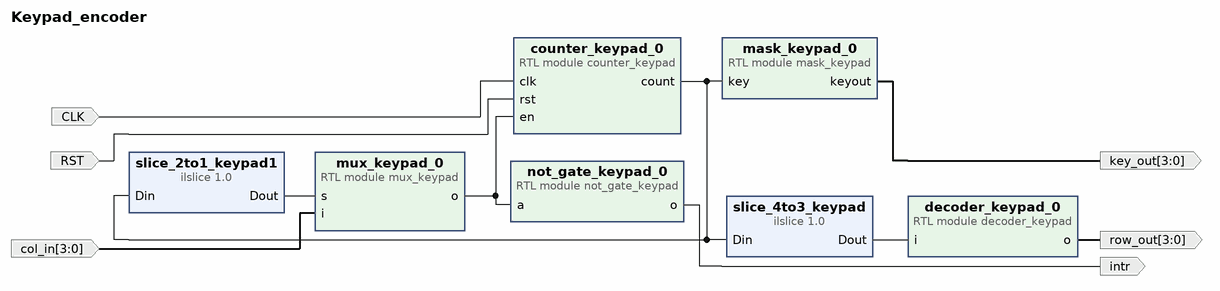
[diagram p0: block diagram of the top level]
# Vivado block design Keypad_encoder, xc7z020clg400-1, Vivado 2025.2
create_bd_design Keypad_encoder

create_bd_port -dir O intr
create_bd_port -dir O -from 3 -to 0 key_out
create_bd_port -dir I -type clk CLK
set_property -dict {CONFIG.FREQ_HZ 100000000} [get_bd_ports CLK]
create_bd_port -dir I -type rst RST
set_property -dict {CONFIG.POLARITY ACTIVE_HIGH} [get_bd_ports RST]
create_bd_port -dir I -from 3 -to 0 col_in
create_bd_port -dir O -from 3 -to 0 row_out

create_bd_cell -type module -reference counter_keypad counter_keypad_0
create_bd_cell -type module -reference decoder_keypad decoder_keypad_0
create_bd_cell -type module -reference mux_keypad mux_keypad_0
create_bd_cell -type module -reference not_gate_keypad not_gate_keypad_0
create_bd_cell -type inline_hdl -vlnv xilinx.com:inline_hdl:ilslice:1.0 slice_4to3_keypad
set_property -dict {CONFIG.DIN_FROM 3 CONFIG.DIN_TO 2 CONFIG.DIN_WIDTH 4} [get_bd_cells slice_4to3_keypad]
create_bd_cell -type inline_hdl -vlnv xilinx.com:inline_hdl:ilslice:1.0 slice_2to1_keypad1
set_property -dict {CONFIG.DIN_FROM 1 CONFIG.DIN_TO 0 CONFIG.DIN_WIDTH 4} [get_bd_cells slice_2to1_keypad1]
create_bd_cell -type module -reference mask_keypad mask_keypad_0

# ---- connections ----

connect_bd_net [get_bd_ports CLK] [get_bd_pins counter_keypad_0/clk]
connect_bd_net [get_bd_ports RST] [get_bd_pins counter_keypad_0/rst]
connect_bd_net [get_bd_ports col_in] [get_bd_pins mux_keypad_0/i]
connect_bd_net [get_bd_pins counter_keypad_0/count] \
  [get_bd_pins slice_2to1_keypad1/Din] [get_bd_pins slice_4to3_keypad/Din] [get_bd_pins mask_keypad_0/key]
connect_bd_net [get_bd_pins decoder_keypad_0/o] [get_bd_ports row_out]
connect_bd_net -net mask_keypad_0_key_correct [get_bd_pins mask_keypad_0/keyout] [get_bd_ports key_out]
connect_bd_net -net mux_keypad_0_key [get_bd_pins mux_keypad_0/o] [get_bd_pins not_gate_keypad_0/a] [get_bd_pins counter_keypad_0/en]
connect_bd_net [get_bd_pins not_gate_keypad_0/o] [get_bd_ports intr]
connect_bd_net [get_bd_pins slice_2to1_keypad1/Dout] [get_bd_pins mux_keypad_0/s]
connect_bd_net [get_bd_pins slice_4to3_keypad/Dout] [get_bd_pins decoder_keypad_0/i]

validate_bd_design
save_bd_design
